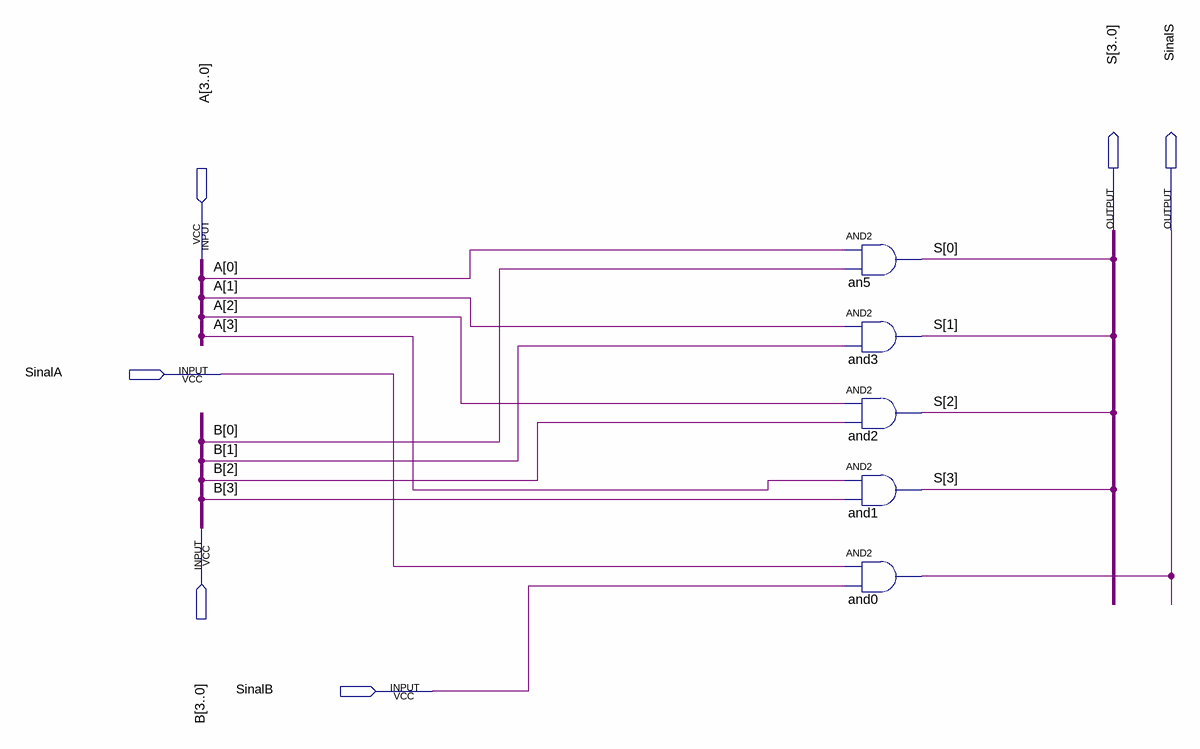
[diagram p0: schematic sheet]
// Quartus schematic AandB.bdf as structural Verilog: 5 symbols, 6 pins
module AandB (
  input  [3:0] A,
  input  SinalA,
  input  [3:0] B,
  input  SinalB,
  output [3:0] S,
  output SinalS
);

  and an5 (S[0], A[0], B[0]);
  and and3 (S[1], A[1], B[1]);
  and and2 (S[2], A[2], B[2]);
  and and1 (S[3], A[3], B[3]);
  and and0 (SinalS, SinalA, SinalB);
endmodule
